# EAGLE schematic Replicape_B3A (EAGLE 7.2.0)
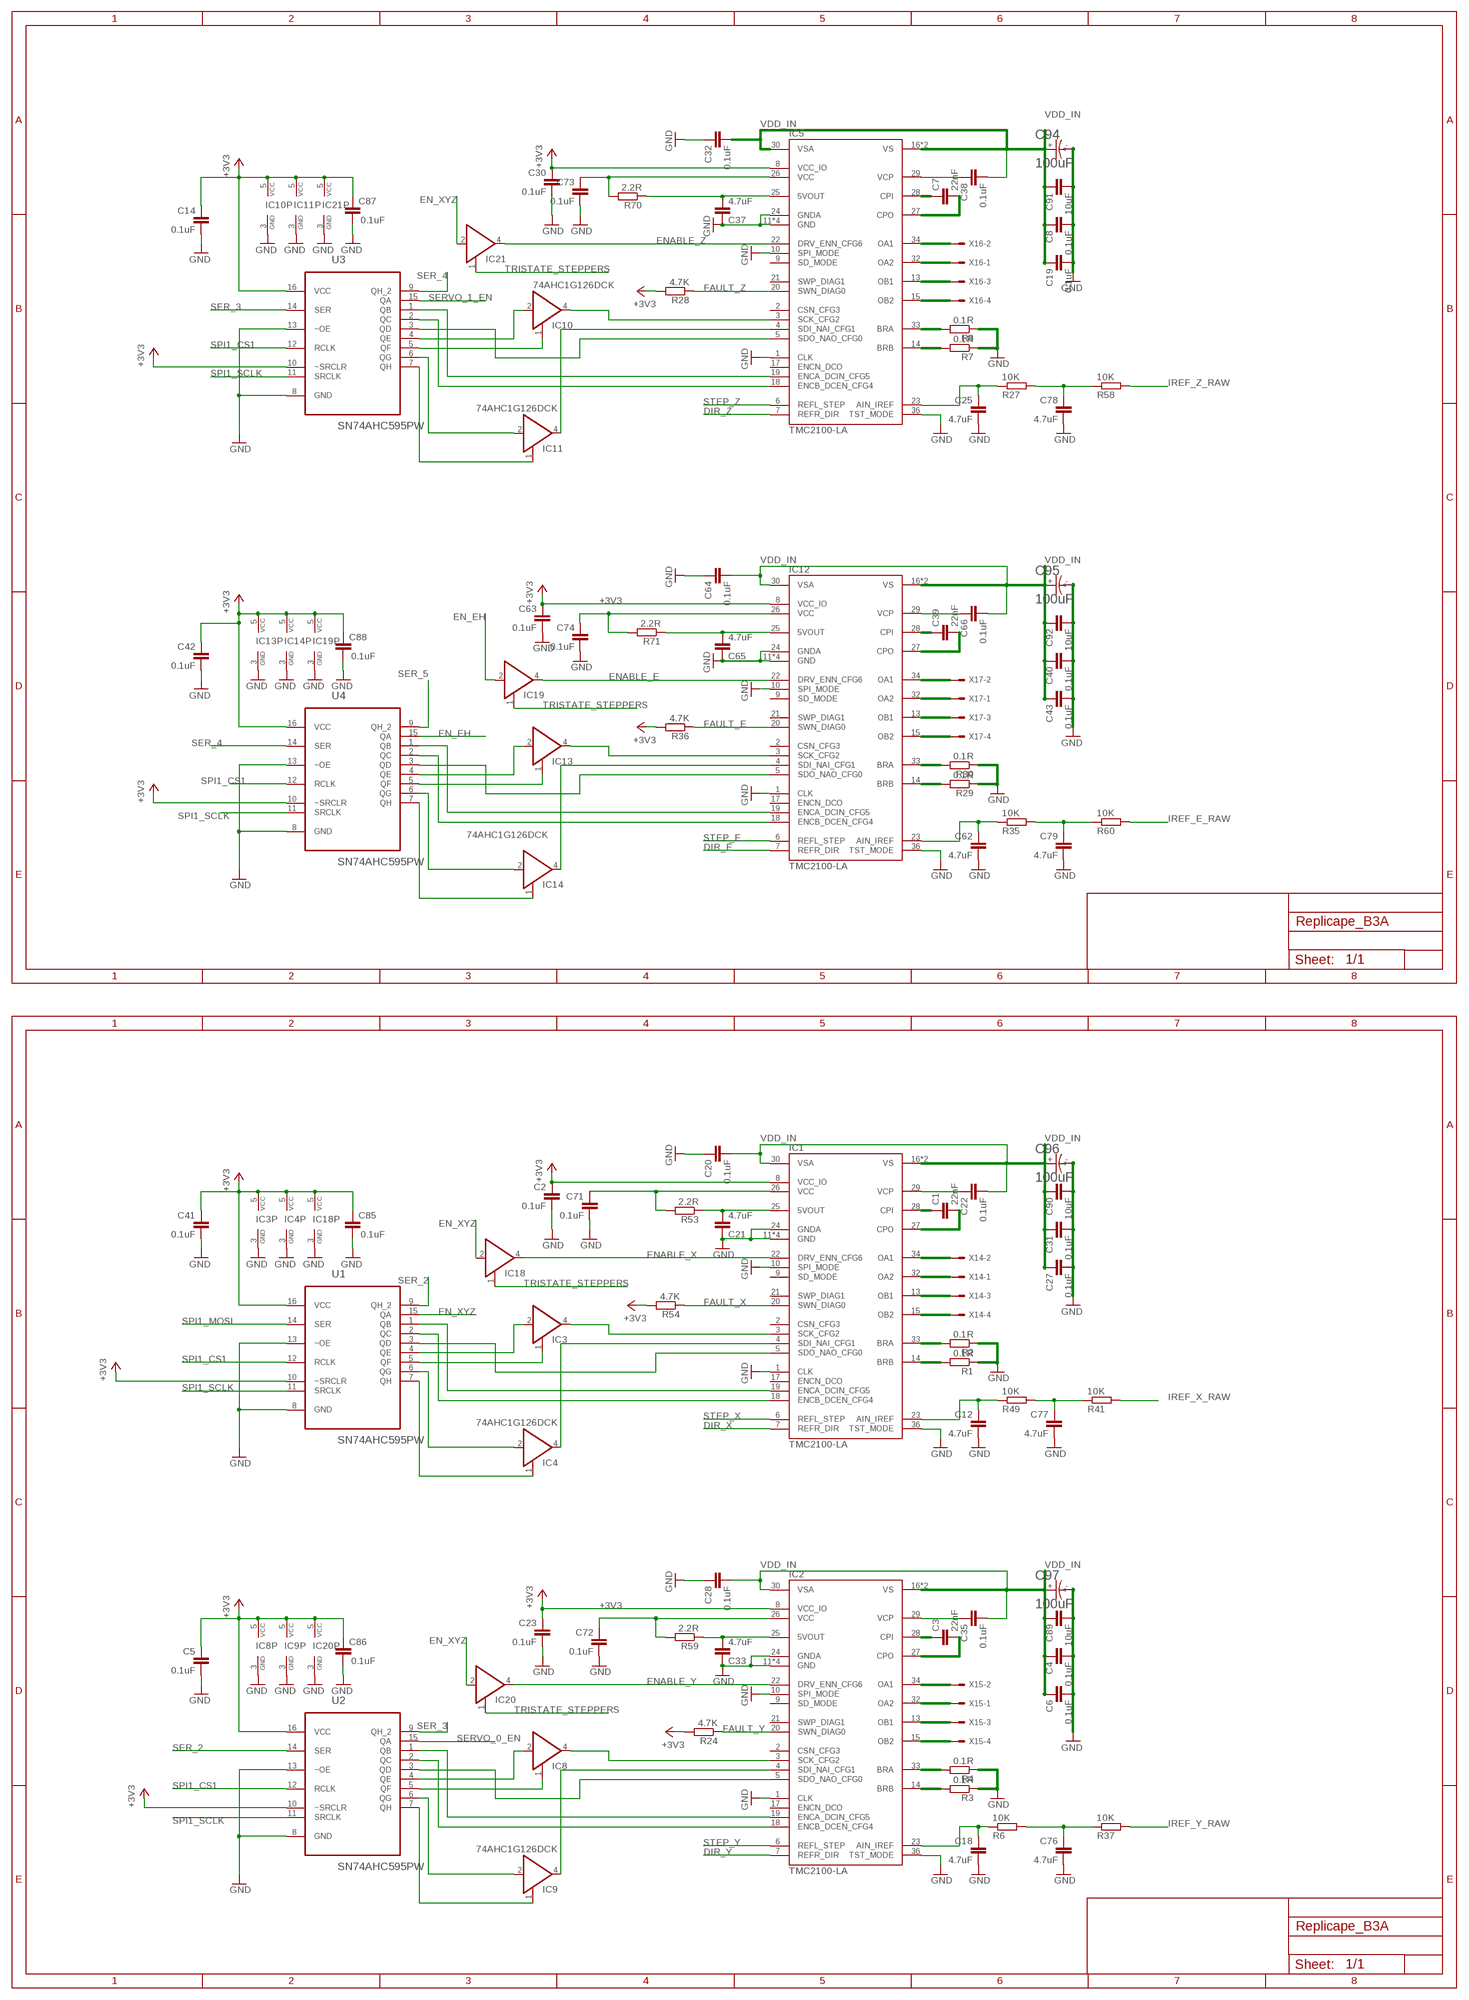
[diagram p0: schematic, sheet 1, part 1 of 3]
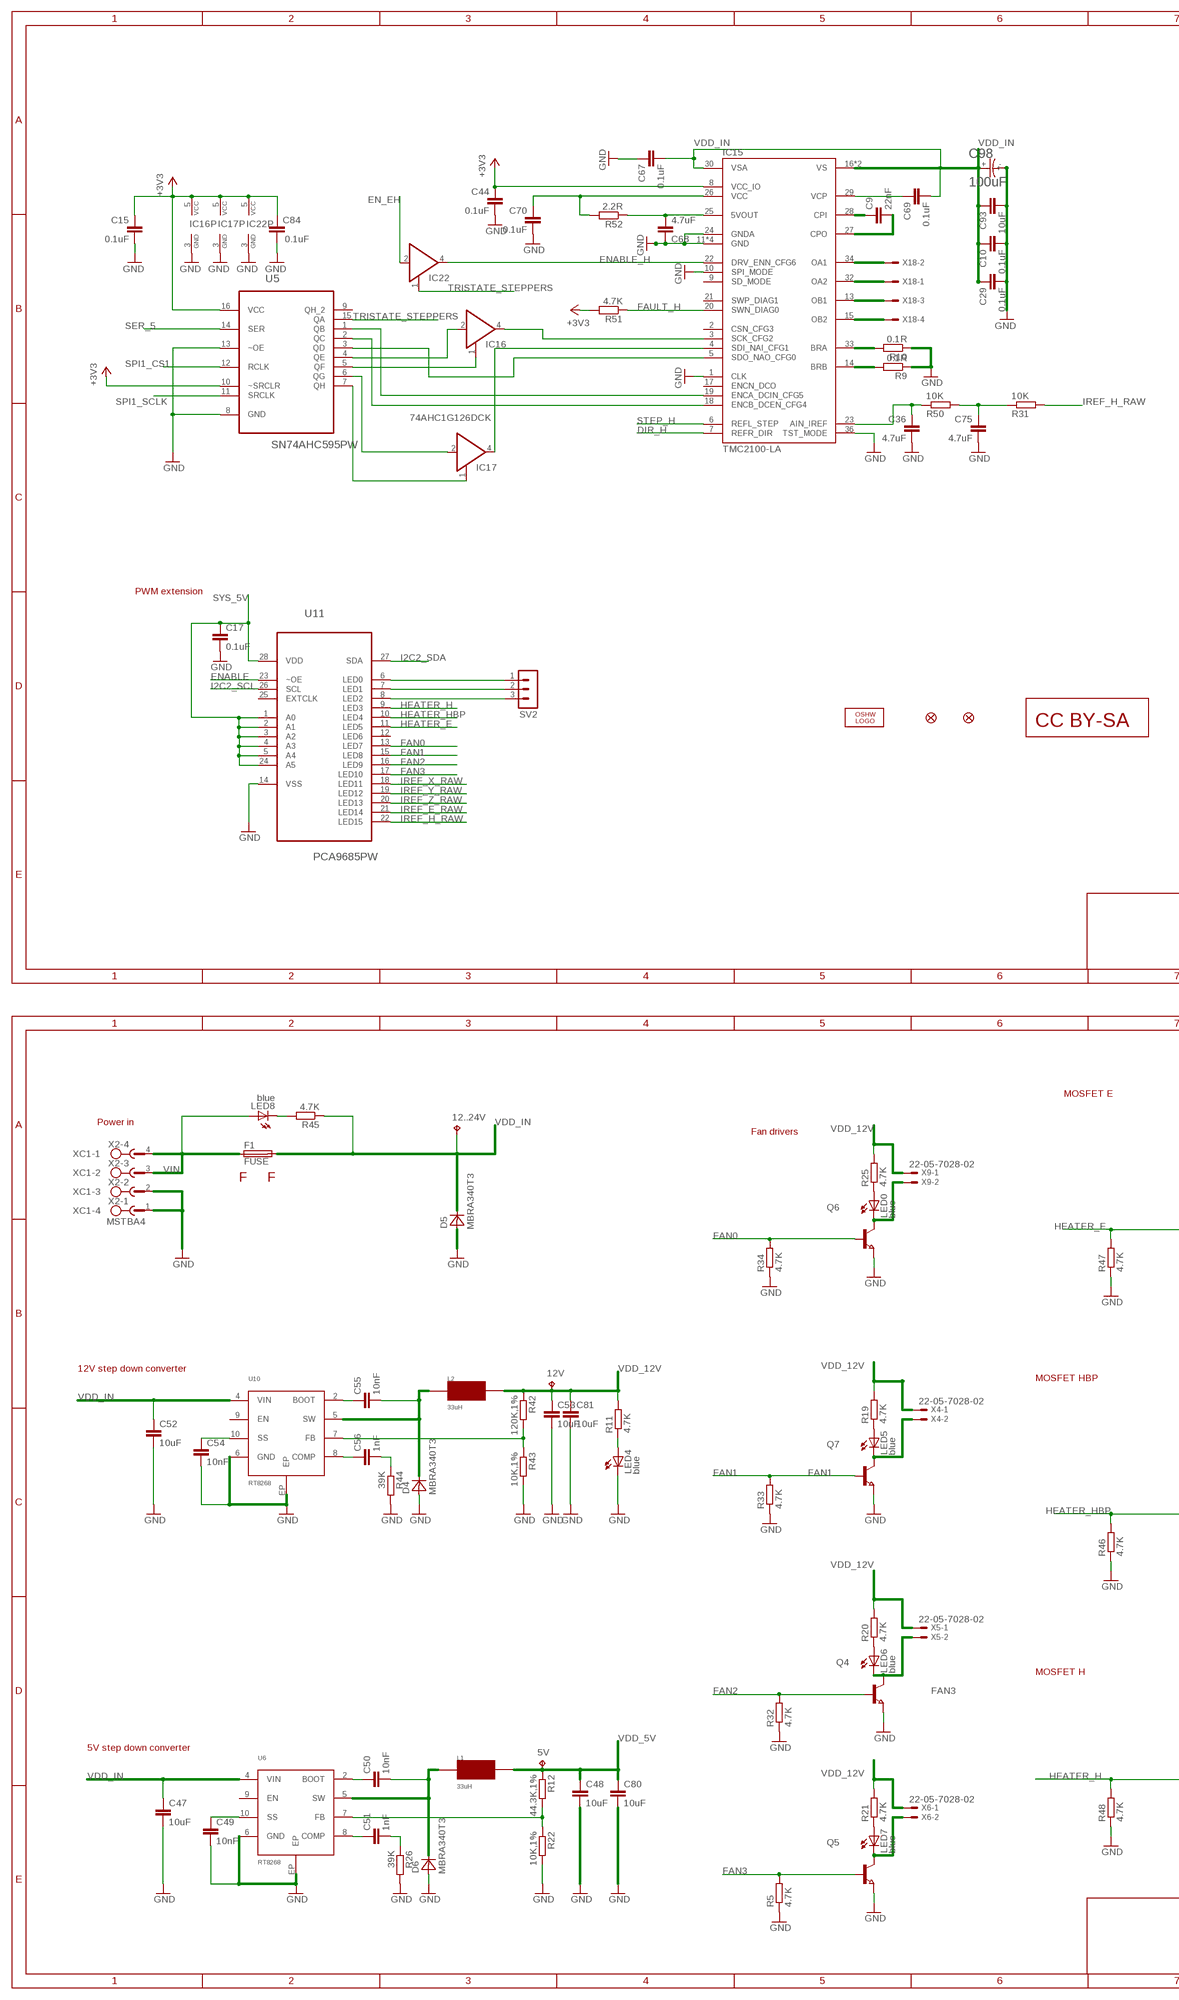
[diagram p1: schematic, sheet 1, part 2 of 3]
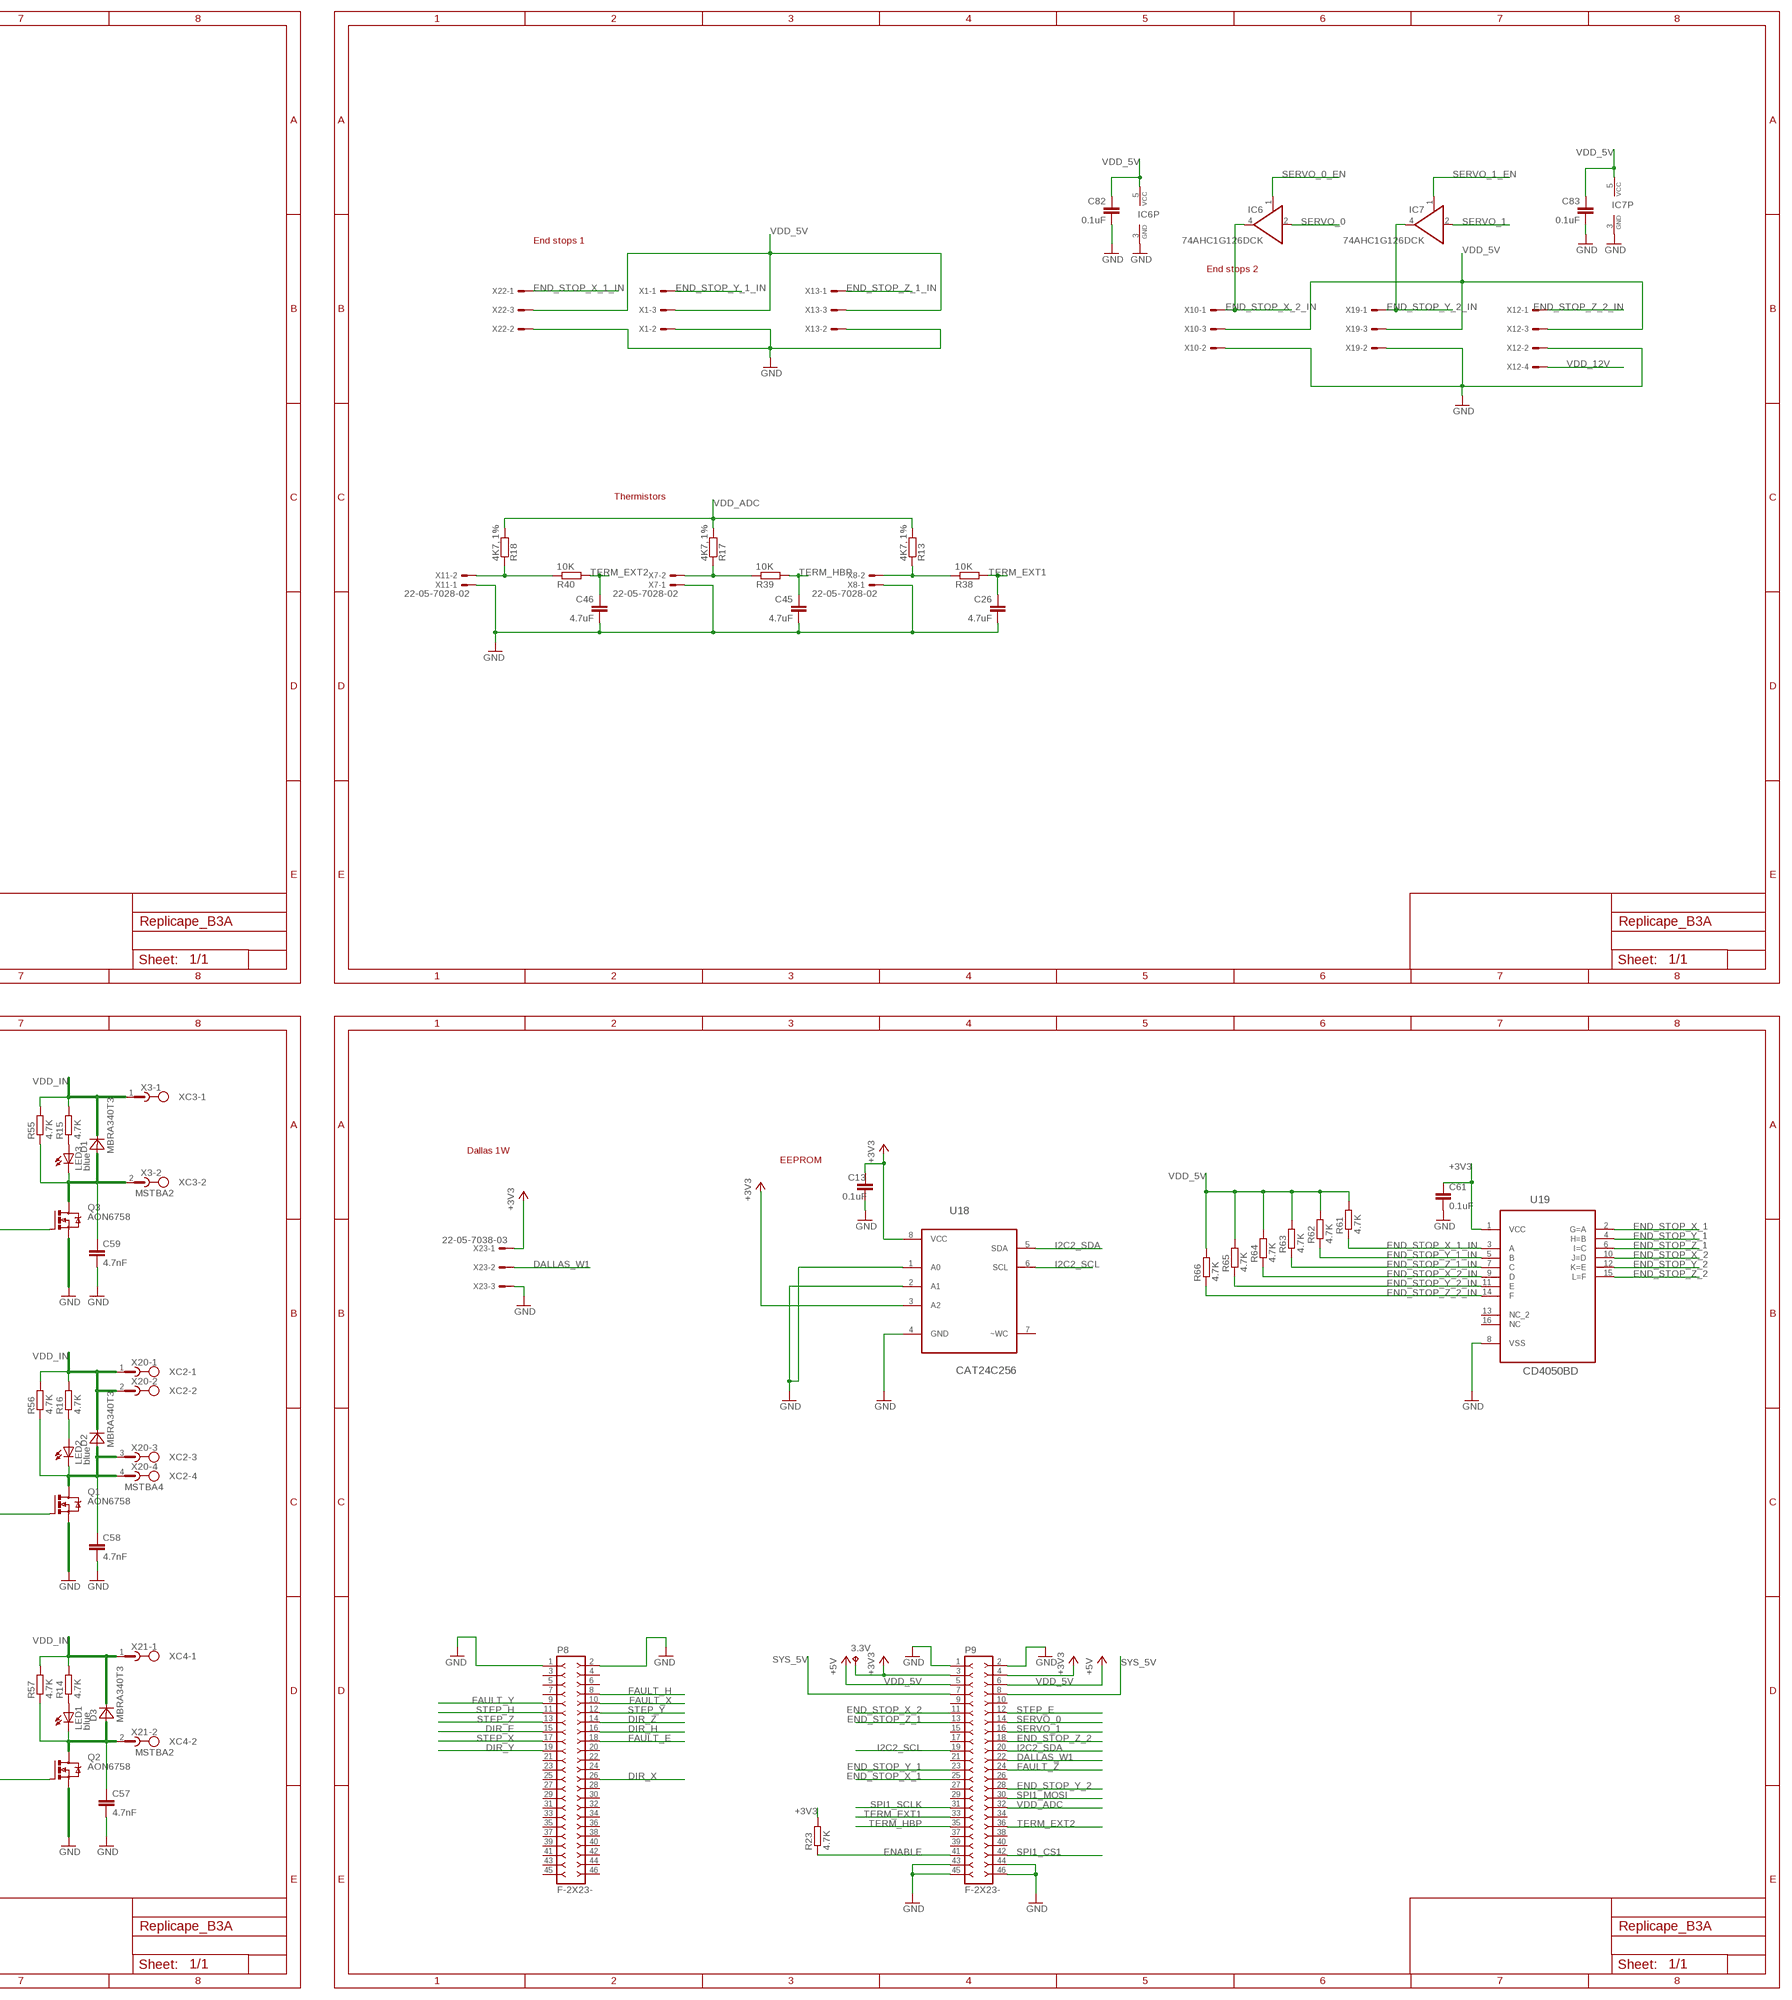
[diagram p2: schematic, sheet 1, part 3 of 3]

## Parts
3.3V  TPB1,27  [B1,27]
5V  TPB1,27  [B1,27]
12..24V  TPB1,27  [B1,27]
12V  TPB1,27  [B1,27]
C1  22nF  C-EUC0402  [C0402]
C2  0.1uF  C-EUC0402  [C0402]
C3  22nF  C-EUC0402  [C0402]
C4  0.1uF  C-EUC0402  [C0402]
C5  0.1uF  C-EUC0402  [C0402]
C6  0.1uF  C-EUC0402  [C0402]
C7  22nF  C-EUC0402  [C0402]
C8  0.1uF  C-EUC0402  [C0402]
C9  22nF  C-EUC0402  [C0402]
C10  0.1uF  C-EUC0402  [C0402]
C12  4.7uF  C-EUC0402  [C0402]
C13  0.1uF  C-EUC0402  [C0402]
C14  0.1uF  C-EUC0402  [C0402]
C15  0.1uF  C-EUC0402  [C0402]
C17  0.1uF  C-EUC0402  [C0402]
C18  4.7uF  C-EUC0402  [C0402]
C19  0.1uF  C-EUC0402  [C0402]
C20  0.1uF  C-EUC0402  [C0402]
C21  4.7uF  C-EUC0402  [C0402]
C22  0.1uF  C-EUC0402  [C0402]
C23  0.1uF  C-EUC0402  [C0402]
C25  4.7uF  C-EUC0402  [C0402]
C26  4.7uF  C-EUC0402  [C0402]
C27  0.1uF  C-EUC0402  [C0402]
C28  0.1uF  C-EUC0402  [C0402]
C29  0.1uF  C-EUC0402  [C0402]
C30  0.1uF  C-EUC0402  [C0402]
C31  0.1uF  C-EUC0402  [C0402]
C32  0.1uF  C-EUC0402  [C0402]
C33  4.7uF  C-EUC0402  [C0402]
C35  0.1uF  C-EUC0402  [C0402]
C36  4.7uF  C-EUC0402  [C0402]
C37  4.7uF  C-EUC0402  [C0402]
C38  0.1uF  C-EUC0402  [C0402]
C39  22nF  C-EUC0402  [C0402]
C40  0.1uF  C-EUC0402  [C0402]
C41  0.1uF  C-EUC0402  [C0402]
C42  0.1uF  C-EUC0402  [C0402]
C43  0.1uF  C-EUC0402  [C0402]
C44  0.1uF  C-EUC0402  [C0402]
C45  4.7uF  C-EUC0402  [C0402]
C46  4.7uF  C-EUC0402  [C0402]
C47  10uF  C-EUC1206  [C1206]
C48  10uF  C-EUC1206  [C1206]
C49  10nF  C-EUC0402  [C0402]
C50  10nF  C-EUC0402  [C0402]
C51  1nF  C-EUC0402  [C0402]
C52  10uF  C-EUC1206  [C1206]
C53  10uF  C-EUC1206  [C1206]
C54  10nF  C-EUC0402  [C0402]
C55  10nF  C-EUC0402  [C0402]
C56  1nF  C-EUC0402  [C0402]
C57  4.7nF  C-EUC0402  [C0402]
C58  4.7nF  C-EUC0402  [C0402]
C59  4.7nF  C-EUC0402  [C0402]
C61  0.1uF  C-EUC0402  [C0402]
C62  4.7uF  C-EUC0402  [C0402]
C63  0.1uF  C-EUC0402  [C0402]
C64  0.1uF  C-EUC0402  [C0402]
C65  4.7uF  C-EUC0402  [C0402]
C66  0.1uF  C-EUC0402  [C0402]
C67  0.1uF  C-EUC0402  [C0402]
C68  4.7uF  C-EUC0402  [C0402]
C69  0.1uF  C-EUC0402  [C0402]
C70  0.1uF  C-EUC0402  [C0402]
C71  0.1uF  C-EUC0402  [C0402]
C72  0.1uF  C-EUC0402  [C0402]
C73  0.1uF  C-EUC0402  [C0402]
C74  0.1uF  C-EUC0402  [C0402]
C75  4.7uF  C-EUC0402  [C0402]
C76  4.7uF  C-EUC0402  [C0402]
C77  4.7uF  C-EUC0402  [C0402]
C78  4.7uF  C-EUC0402  [C0402]
C79  4.7uF  C-EUC0402  [C0402]
C80  10uF  C-EUC1206  [C1206]
C81  10uF  C-EUC1206  [C1206]
C82  0.1uF  C-EUC0402  [C0402]
C83  0.1uF  C-EUC0402  [C0402]
C84  0.1uF  C-EUC0402  [C0402]
C85  0.1uF  C-EUC0402  [C0402]
C86  0.1uF  C-EUC0402  [C0402]
C87  0.1uF  C-EUC0402  [C0402]
C88  0.1uF  C-EUC0402  [C0402]
C89  10uF  C-EUC0805  [C0805]
C90  10uF  C-EUC0805  [C0805]
C91  10uF  C-EUC0805  [C0805]
C92  10uF  C-EUC0805  [C0805]
C93  10uF  C-EUC0805  [C0805]
C94  100uF  C  [RHS1V10MCN1GS]
C95  100uF  C  [RHS1V10MCN1GS]
C96  100uF  C  [RHS1V10MCN1GS]
C97  100uF  C  [RHS1V10MCN1GS]
C98  100uF  C  [RHS1V10MCN1GS]
D1  MBRA340T3  [SMA]
D2  MBRA340T3  [SMA]
D3  MBRA340T3  [SMA]
D4  MBRA340T3  [SMA]
D5  MBRA340T3  [SMA]
D6  MBRA340T3  [SMA]
F1  FUSE  [3557]
FH1  FUSE-HOLDER  [FUSE-HOLDER]
FH2  FUSE-HOLDER  [FUSE-HOLDER]
IC1  TMC2100-LA  [QFN36-PAD]
IC2  TMC2100-LA  [QFN36-PAD]
IC3  74AHC1G126DCK  [SC70-5]
IC4  74AHC1G126DCK  [SC70-5]
IC5  TMC2100-LA  [QFN36-PAD]
IC6  74AHC1G126DCK  [SC70-5]
IC7  74AHC1G126DCK  [SC70-5]
IC8  74AHC1G126DCK  [SC70-5]
IC9  74AHC1G126DCK  [SC70-5]
IC10  74AHC1G126DCK  [SC70-5]
IC11  74AHC1G126DCK  [SC70-5]
IC12  TMC2100-LA  [QFN36-PAD]
IC13  74AHC1G126DCK  [SC70-5]
IC14  74AHC1G126DCK  [SC70-5]
IC15  TMC2100-LA  [QFN36-PAD]
IC16  74AHC1G126DCK  [SC70-5]
IC17  74AHC1G126DCK  [SC70-5]
IC18  74AHC1G126DCK  [SC70-5]
IC19  74AHC1G126DCK  [SC70-5]
IC20  74AHC1G126DCK  [SC70-5]
IC21  74AHC1G126DCK  [SC70-5]
IC22  74AHC1G126DCK  [SC70-5]
JP1  FIDUCIAL1X2.5  [FIDUCIAL-1X2.5]
JP2  FIDUCIAL1X2.5  [FIDUCIAL-1X2.5]
L1  33uH  RT8040T330  [NR8040T330]
L2  33uH  RT8040T330  [NR8040T330]
LED0  blue  LEDCHIP-LED0603  [CHIP-LED0603]
LED1  blue  LEDCHIP-LED0603  [CHIP-LED0603]
LED2  blue  LEDCHIP-LED0603  [CHIP-LED0603]
LED3  blue  LEDCHIP-LED0603  [CHIP-LED0603]
LED4  blue  LEDCHIP-LED0603  [CHIP-LED0603]
LED5  blue  LEDCHIP-LED0603  [CHIP-LED0603]
LED6  blue  LEDCHIP-LED0603  [CHIP-LED0603]
LED7  blue  LEDCHIP-LED0603  [CHIP-LED0603]
LED8  blue  LEDCHIP-LED0603  [CHIP-LED0603]
LOGO1  OSHW_LOGO_FILLX0200-NT  [OSHW_FILLX200_NOTEXT]
P8  F-2X23-  [DIL-100-2X23]
P9  F-2X23-  [DIL-100-2X23]
Q1  AON6758  [8-DFN-EP-(5X6)]
Q2  AON6758  [8-DFN-EP-(5X6)]
Q3  AON6758  [8-DFN-EP-(5X6)]
Q4  NPN-TRANSISTOR_SOT23  [SOT23]
Q5  NPN-TRANSISTOR_SOT23  [SOT23]
Q6  NPN-TRANSISTOR_SOT23  [SOT23]
Q7  NPN-TRANSISTOR_SOT23  [SOT23]
R1  0.1R  R-EU_R0805  [R0805]
R2  0.1R  R-EU_R0805  [R0805]
R3  0.1R  R-EU_R0805  [R0805]
R4  0.1R  R-EU_R0805  [R0805]
R5  4.7K  R-EU_R0402  [R0402]
R6  10K  R-EU_R0402  [R0402]
R7  0.1R  R-EU_R0805  [R0805]
R8  0.1R  R-EU_R0805  [R0805]
R9  0.1R  R-EU_R0805  [R0805]
R10  0.1R  R-EU_R0805  [R0805]
R11  4.7K  R-EU_R0402  [R0402]
R12  44.3K,1%  R-EU_R0402  [R0402]
R13  4K7, 1%  R-EU_R0402  [R0402]
R14  4.7K  R-EU_R0402  [R0402]
R15  4.7K  R-EU_R0402  [R0402]
R16  4.7K  R-EU_R0402  [R0402]
R17  4K7, 1%  R-EU_R0402  [R0402]
R18  4K7, 1%  R-EU_R0402  [R0402]
R19  4.7K  R-EU_R0402  [R0402]
R20  4.7K  R-EU_R0402  [R0402]
R21  4.7K  R-EU_R0402  [R0402]
R22  10K,1%  R-EU_R0402  [R0402]
R23  4.7K  R-EU_R0402  [R0402]
R24  4.7K  R-EU_R0402  [R0402]
R25  4.7K  R-EU_R0402  [R0402]
R26  39K  R-EU_R0402  [R0402]
R27  10K  R-EU_R0402  [R0402]
R28  4.7K  R-EU_R0402  [R0402]
R29  0.1R  R-EU_R0805  [R0805]
R30  0.1R  R-EU_R0805  [R0805]
R31  10K  R-EU_R0402  [R0402]
R32  4.7K  R-EU_R0402  [R0402]
R33  4.7K  R-EU_R0402  [R0402]
R34  4.7K  R-EU_R0402  [R0402]
R35  10K  R-EU_R0402  [R0402]
R36  4.7K  R-EU_R0402  [R0402]
R37  10K  R-EU_R0402  [R0402]
R38  10K  R-EU_R0402  [R0402]
R39  10K  R-EU_R0402  [R0402]
R40  10K  R-EU_R0402  [R0402]
R41  10K  R-EU_R0402  [R0402]
R42  120K,1%  R-EU_R0402  [R0402]
R43  10K,1%  R-EU_R0402  [R0402]
R44  39K  R-EU_R0402  [R0402]
R45  4.7K  R-EU_R0402  [R0402]
R46  4.7K  R-EU_R0402  [R0402]
R47  4.7K  R-EU_R0402  [R0402]
R48  4.7K  R-EU_R0402  [R0402]
R49  10K  R-EU_R0402  [R0402]
R50  10K  R-EU_R0402  [R0402]
R51  4.7K  R-EU_R0402  [R0402]
R52  2.2R  R-EU_R0402  [R0402]
R53  2.2R  R-EU_R0402  [R0402]
R54  4.7K  R-EU_R0402  [R0402]
R55  4.7K  R-EU_R0402  [R0402]
R56  4.7K  R-EU_R0402  [R0402]
R57  4.7K  R-EU_R0402  [R0402]
R58  10K  R-EU_R0402  [R0402]
R59  2.2R  R-EU_R0402  [R0402]
R60  10K  R-EU_R0402  [R0402]
R61  4.7K  R-EU_R0402  [R0402]
R62  4.7K  R-EU_R0402  [R0402]
R63  4.7K  R-EU_R0402  [R0402]
R64  4.7K  R-EU_R0402  [R0402]
R65  4.7K  R-EU_R0402  [R0402]
R66  4.7K  R-EU_R0402  [R0402]
R70  2.2R  R-EU_R0402  [R0402]
R71  2.2R  R-EU_R0402  [R0402]
SV2  MA03-1  [MA03-1]
U1  SN74AHC595PW  [SOP65P640X120-16N]
U2  SN74AHC595PW  [SOP65P640X120-16N]
U3  SN74AHC595PW  [SOP65P640X120-16N]
U4  SN74AHC595PW  [SOP65P640X120-16N]
U5  SN74AHC595PW  [SOP65P640X120-16N]
U6  RT8268  [MSOP10]
U10  RT8268  [MSOP10]
U11  PCA9685PW  [SOP65P640X110-28N]
U18  CAT24C256  [SOIC127P600X175-8N]
U19  CD4050BD  [SOIC127P600X175-16N]
U$4  CC-BY-SA  [CC-BY-SA]
X1  22-05-7038-03  [7395-03]
X2  MSTBA4  [MSTBA4]
X3  MSTBA2  [MSTBA2]
X4  22-05-7028-02  [7395-02]
X5  22-05-7028-02  [7395-02]
X6  22-05-7028-02  [7395-02]
X7  22-05-7028-02  [7395-02]
X8  22-05-7028-02  [7395-02]
X9  22-05-7028-02  [7395-02]
X10  22-05-7038-03  [7395-03]
X11  22-05-7028-02  [7395-02]
X12  22-05-7048-04  [7395-04]
X13  22-05-7038-03  [7395-03]
X14  22-05-7048-04  [7395-04]
X15  22-05-7048-04  [7395-04]
X16  22-05-7048-04  [7395-04]
X17  22-05-7048-04  [7395-04]
X18  22-05-7048-04  [7395-04]
X19  22-05-7038-03  [7395-03]
X20  MSTBA4  [MSTBA4]
X21  MSTBA2  [MSTBA2]
X22  22-05-7038-03  [7395-03]
X23  22-05-7038-03  [7395-03]
XC1  MSTBA4-CONNECTOR  [MSTBA4-CONNECTOR]
XC2  MSTBA4-CONNECTOR  [MSTBA4-CONNECTOR]
XC3  MSTBV2-CONNECTOR  [MSTBA2-CONNECTOR]
XC4  MSTBV2-CONNECTOR  [MSTBA2-CONNECTOR]

## Nets
+3V3: 3.3V.TP C2.1 C5.1 C13.1 C14.1 C15.1 C23.1 C30.1 C41.1 C42.1 C44.1 C61.1 C63.1 C84.1 C85.1 C86.1 C87.1 C88.1 IC1.8(VCC_IO) IC2.8(VCC_IO) IC3.5(VCC) IC4.5(VCC) IC5.8(VCC_IO) IC8.5(VCC) IC9.5(VCC) IC10.5(VCC) IC11.5(VCC) IC12.8(VCC_IO) IC13.5(VCC) IC14.5(VCC) IC15.8(VCC_IO) IC16.5(VCC) IC17.5(VCC) IC18.5(VCC) IC19.5(VCC) IC20.5(VCC) IC21.5(VCC) IC22.5(VCC) P9.3 P9.4 R23.2 R24.2 R28.2 R36.2 R51.2 R54.2 U1.10(~SRCLR) U1.16(VCC) U2.10(~SRCLR) U2.16(VCC) U3.10(~SRCLR) U3.16(VCC) U4.10(~SRCLR) U4.16(VCC) U5.10(~SRCLR) U5.16(VCC) U18.3(A2) U18.8(VCC) U19.1(VCC) X23.1
DALLAS_W1: P9.22 X23.2
DIR_E: IC12.7(REFR_DIR) P8.15
DIR_H: IC15.7(REFR_DIR) P8.16
DIR_X: IC1.7(REFR_DIR) P8.26
DIR_Y: IC2.7(REFR_DIR) P8.19
DIR_Z: IC5.7(REFR_DIR) P8.14
EN_EH: IC19.2(I) IC22.2(I) U4.15(QA)
EN_XYZ: IC18.2(I) IC20.2(I) IC21.2(I) U1.15(QA)
ENABLE: P9.41 R23.1 U11.23(~OE)
ENABLE_E: IC12.22(DRV_ENN_CFG6) IC19.4(O)
ENABLE_H: IC15.22(DRV_ENN_CFG6) IC22.4(O)
ENABLE_X: IC1.22(DRV_ENN_CFG6) IC18.4(O)
ENABLE_Y: IC2.22(DRV_ENN_CFG6) IC20.4(O)
ENABLE_Z: IC5.22(DRV_ENN_CFG6) IC21.4(O)
END_STOP_X_1: P9.25 U19.2(G=A)
END_STOP_X_1_IN: R61.1 U19.3(A) X22.1
END_STOP_X_2: P9.11 U19.10(J=D)
END_STOP_X_2_IN: IC6.4(O) R64.1 U19.9(D) X10.1
END_STOP_Y_1: P9.23 U19.4(H=B)
END_STOP_Y_1_IN: R62.1 U19.5(B) X1.1
END_STOP_Y_2: P9.28 U19.12(K=E)
END_STOP_Y_2_IN: IC7.4(O) R65.1 U19.11(E) X19.1
END_STOP_Z_1: P9.13 U19.6(I=C)
END_STOP_Z_1_IN: R63.1 U19.7(C) X13.1
END_STOP_Z_2: P9.18 U19.15(L=F)
END_STOP_Z_2_IN: R66.1 U19.14(F) X12.1
FAN0: Q6.1(B) R34.2 U11.13(LED7)
FAN1: Q7.1(B) R33.2 U11.15(LED8)
FAN2: Q4.1(B) R32.2 U11.16(LED9)
FAN3: Q5.1(B) R5.2 U11.17(LED10)
FAULT_E: IC12.20(SWN_DIAG0) P8.18 R36.1
FAULT_H: IC15.20(SWN_DIAG0) P8.8 R51.1
FAULT_X: IC1.20(SWN_DIAG0) P8.10 R54.1
FAULT_Y: IC2.20(SWN_DIAG0) P8.9 R24.1
FAULT_Z: IC5.20(SWN_DIAG0) P9.24 R28.1
GND: C2.2 C4.2 C5.2 C6.2 C8.2 C10.2 C12.2 C13.2 C14.2 C15.2 C17.2 C18.2 C19.2 C20.1 C21.1 C23.2 C25.2 C26.2 C27.2 C28.1 C29.2 C30.2 C31.2 C32.1 C33.1 C36.2 C37.1 C40.2 C41.2 C42.2 C43.2 C44.2 C45.2 C46.2 C47.2 C48.2 C49.2 C52.2 C53.2 C54.2 C57.2 C58.2 C59.2 C61.2 C62.2 C63.2 C64.1 C65.1 C67.1 C68.1 C70.2 C71.2 C72.2 C73.2 C74.2 C75.2 C76.2 C77.2 C78.2 C79.2 C80.2 C81.2 C82.2 C83.2 C84.2 C85.2 C86.2 C87.2 C88.2 C89.2 C90.2 C91.2 C92.2 C93.2 C94.- C95.- C96.- C97.- C98.- D4.A D5.A D6.A IC1.1(CLK) IC1.10(SPI_MODE) IC1.11(GND) IC1.12(GND) IC1.24(GNDA) IC1.35(GND) IC1.36(TST_MODE) IC1.TP(GND) IC2.1(CLK) IC2.10(SPI_MODE) IC2.11(GND) IC2.12(GND) IC2.24(GNDA) IC2.35(GND) IC2.36(TST_MODE) IC2.TP(GND) IC3.3(GND) IC4.3(GND) IC5.1(CLK) IC5.10(SPI_MODE) IC5.11(GND) IC5.12(GND) IC5.24(GNDA) IC5.35(GND) IC5.36(TST_MODE) IC5.TP(GND) IC6.3(GND) IC7.3(GND) IC8.3(GND) IC9.3(GND) IC10.3(GND) IC11.3(GND) IC12.1(CLK) IC12.10(SPI_MODE) IC12.11(GND) IC12.12(GND) IC12.24(GNDA) IC12.35(GND) IC12.36(TST_MODE) IC12.TP(GND) IC13.3(GND) IC14.3(GND) IC15.1(CLK) IC15.10(SPI_MODE) IC15.11(GND) IC15.12(GND) IC15.24(GNDA) IC15.35(GND) IC15.36(TST_MODE) IC15.TP(GND) IC16.3(GND) IC17.3(GND) IC18.3(GND) IC19.3(GND) IC20.3(GND) IC21.3(GND) IC22.3(GND) LED4.C P8.1 P8.2 P9.1 P9.2 P9.43 P9.44 P9.45 P9.46 Q1.1(S) Q1.2(S) Q1.3(S) Q2.1(S) Q2.2(S) Q2.3(S) Q3.1(S) Q3.2(S) Q3.3(S) Q4.2(E) Q5.2(E) Q6.2(E) Q7.2(E) R1.1 R2.1 R3.1 R4.1 R5.1 R7.1 R8.1 R9.1 R10.1 R22.2 R26.2 R29.1 R30.1 R32.1 R33.1 R34.1 R43.2 R44.2 R46.1 R47.1 R48.1 U1.8(GND) U1.13(~OE) U2.8(GND) U2.13(~OE) U3.8(GND) U3.13(~OE) U4.8(GND) U4.13(~OE) U5.8(GND) U5.13(~OE) U6.6(GND) U6.EP U10.6(GND) U10.EP U11.14(VSS) U18.1(A0) U18.2(A1) U18.4(GND) U19.8(VSS) X1.2 X2.1 X2.2 X7.1 X8.1 X10.2 X11.1 X12.2 X13.2 X19.2 X22.2 X23.3
HEATER_E: Q3.4(G) R47.2 U11.11(LED5)
HEATER_H: Q2.4(G) R48.2 U11.9(LED3)
HEATER_HBP: Q1.4(G) R46.2 U11.10(LED4)
I2C2_SCL: P9.19 U11.26(SCL) U18.6(SCL)
I2C2_SDA: P9.20 U11.27(SDA) U18.5(SDA)
IREF_E: C79.1 R35.2 R60.1
IREF_E_RAW: R60.2 U11.21(LED14)
IREF_H: C75.1 R31.1 R50.2
IREF_H_RAW: R31.2 U11.22(LED15)
IREF_X: C77.1 R41.1 R49.2
IREF_X_RAW: R41.2 U11.18(LED11)
IREF_Y: C76.1 R6.2 R37.1
IREF_Y_RAW: R37.2 U11.19(LED12)
IREF_Z: C78.1 R27.2 R58.1
IREF_Z_RAW: R58.2 U11.20(LED13)
N$1: SV2.1 U11.6(LED0)
N$2: IC2.13(OB1) X15.3
N$3: C3.2 IC2.27(CPO)
N$4: IC4.1(OE) U1.7(QH)
N$5: IC4.2(I) U1.6(QG)
N$6: IC1.18(ENCB_DCEN_CFG4) U1.2(QC)
N$8: LED8.C R45.2
N$9: LED5.A R19.1
N$11: LED0.C Q6.3(C) X9.2
N$12: C9.2 IC15.27(CPO)
N$13: IC15.14(BRB) R9.2
N$14: C7.2 IC5.27(CPO)
N$15: IC5.14(BRB) R7.2
N$16: C1.1 IC1.28(CPI)
N$17: C1.2 IC1.27(CPO)
N$18: IC1.14(BRB) R1.2
N$19: IC1.33(BRA) R2.2
N$20: C12.1 IC1.23(AIN_IREF) R49.1
N$21: LED0.A R25.1
N$22: IC2.32(OA2) X15.1
N$23: R12.2 R22.1 U6.7(FB)
N$24: IC5.33(BRA) R8.2
N$25: C50.2 D6.C L1.P$2 U6.5(SW)
N$26: C25.1 IC5.23(AIN_IREF) R27.1
N$27: C7.1 IC5.28(CPI)
N$28: IC5.3(SCK_CFG2) IC10.4(O)
N$29: IC5.15(OB2) X16.4
N$30: IC15.33(BRA) R10.2
N$31: C21.2 IC1.25(5VOUT) R53.1
N$32: IC5.32(OA2) X16.1
N$33: C22.1 IC1.29(VCP)
N$34: IC3.2(I) U1.4(QE)
N$35: IC2.14(BRB) R3.2
N$36: IC2.33(BRA) R4.2
N$37: IC5.13(OB1) X16.3
N$38: C18.1 IC2.23(AIN_IREF) R6.1
N$39: IC12.13(OB1) X17.3
N$40: IC3.1(OE) U1.5(QF)
N$41: C3.1 IC2.28(CPI)
N$42: IC2.3(SCK_CFG2) IC8.4(O)
N$43: IC1.19(ENCA_DCIN_CFG5) U1.1(QB)
N$44: IC1.5(SDO_NAO_CFG0) U1.3(QD)
N$45: IC2.15(OB2) X15.4
N$46: IC2.34(OA1) X15.2
N$47: C33.2 IC2.25(5VOUT) R59.1
N$48: C35.1 IC2.29(VCP)
N$49: IC2.4(SDI_NAI_CFG1) IC9.4(O)
N$50: IC5.34(OA1) X16.2
N$51: C37.2 IC5.25(5VOUT) R70.1
N$52: C38.1 IC5.29(VCP)
N$53: IC2.5(SDO_NAO_CFG0) U2.3(QD)
N$54: IC5.4(SDI_NAI_CFG1) IC11.4(O)
N$55: IC5.5(SDO_NAO_CFG0) U3.3(QD)
N$56: IC2.18(ENCB_DCEN_CFG4) U2.2(QC)
N$57: IC5.18(ENCB_DCEN_CFG4) U3.2(QC)
N$58: IC5.19(ENCA_DCIN_CFG5) U3.1(QB)
N$59: IC11.1(OE) U3.7(QH)
N$60: C49.1 U6.10(SS)
N$61: IC11.2(I) U3.6(QG)
N$62: IC10.1(OE) U3.5(QF)
N$63: IC10.2(I) U3.4(QE)
N$64: C57.1 D3.A LED1.C Q2.5(D) Q2.6(D) Q2.7(D) Q2.8(D) Q2.TH(D) R57.1 X21.2
N$65: IC2.19(ENCA_DCIN_CFG5) U2.1(QB)
N$66: IC9.1(OE) U2.7(QH)
N$67: IC9.2(I) U2.6(QG)
N$68: IC8.1(OE) U2.5(QF)
N$69: IC8.2(I) U2.4(QE)
N$70: C39.2 IC12.27(CPO)
N$71: IC12.14(BRB) R29.2
N$72: IC12.33(BRA) R30.2
N$73: C50.1 U6.2(BOOT)
N$74: C62.1 IC12.23(AIN_IREF) R35.1
N$75: C39.1 IC12.28(CPI)
N$76: IC12.3(SCK_CFG2) IC13.4(O)
N$77: IC12.15(OB2) X17.4
N$78: IC12.34(OA1) X17.2
N$79: C65.2 IC12.25(5VOUT) R71.1
N$80: C66.1 IC12.29(VCP)
N$81: IC12.4(SDI_NAI_CFG1) IC14.4(O)
N$82: IC12.5(SDO_NAO_CFG0) U4.3(QD)
N$83: IC12.18(ENCB_DCEN_CFG4) U4.2(QC)
N$84: IC12.19(ENCA_DCIN_CFG5) U4.1(QB)
N$85: IC14.1(OE) U4.7(QH)
N$86: IC14.2(I) U4.6(QG)
N$87: IC13.1(OE) U4.5(QF)
N$88: C51.1 U6.8(COMP)
N$89: C36.1 IC15.23(AIN_IREF) R50.1
N$90: C9.1 IC15.28(CPI)
N$91: IC15.3(SCK_CFG2) IC16.4(O)
N$92: IC15.15(OB2) X18.4
N$93: IC13.2(I) U4.4(QE)
N$94: IC15.34(OA1) X18.2
N$95: C68.2 IC15.25(5VOUT) R52.1
N$96: LED4.A R11.1
N$97: C51.2 R26.1
N$98: C69.1 IC15.29(VCP)
N$99: IC15.4(SDI_NAI_CFG1) IC17.4(O)
N$100: IC15.5(SDO_NAO_CFG0) U5.3(QD)
N$101: IC15.18(ENCB_DCEN_CFG4) U5.2(QC)
N$102: IC15.19(ENCA_DCIN_CFG5) U5.1(QB)
N$103: IC17.1(OE) U5.7(QH)
N$104: IC17.2(I) U5.6(QG)
N$105: IC16.1(OE) U5.5(QF)
N$106: IC16.2(I) U5.4(QE)
N$107: C70.1 IC15.26(VCC) R52.2
N$108: C71.1 IC1.26(VCC) R53.2
N$109: C73.1 IC5.26(VCC) R70.2
N$110: C72.1 IC2.26(VCC) R59.2
N$111: C74.1 IC12.26(VCC) R71.2
N$112: IC12.32(OA2) X17.1
N$113: IC15.13(OB1) X18.3
N$114: LED7.C Q5.3(C) X6.2
N$115: LED6.C Q4.3(C) X5.2
N$116: LED5.C Q7.3(C) X4.2
N$117: LED6.A R20.1
N$118: LED7.A R21.1
N$119: IC15.32(OA2) X18.1
N$120: SV2.3 U11.8(LED2)
N$121: SV2.2 U11.7(LED1)
N$127: LED3.A R15.1
N$129: LED1.A R14.1
N$130: LED2.A R16.1
N$233: R42.2 R43.1 U10.7(FB)
N$234: C59.1 D1.A LED3.C Q3.5(D) Q3.6(D) Q3.7(D) Q3.8(D) Q3.TH(D) R55.1 X3.2
N$237: R13.1 R38.1 X8.2
N$238: C55.2 D4.C L2.P$2 U10.5(SW)
N$240: R18.1 R40.1 X11.2
N$241: R17.1 R39.1 X7.2
N$242: C58.1 D2.A LED2.C Q1.5(D) Q1.6(D) Q1.7(D) Q1.8(D) Q1.TH(D) R56.1 X20.3 X20.4
N$243: C54.1 U10.10(SS)
N$244: C56.1 U10.8(COMP)
N$245: C55.1 U10.2(BOOT)
N$246: C56.2 R44.1
SER_2: U1.9(QH_2) U2.14(SER)
SER_3: U2.9(QH_2) U3.14(SER)
SER_4: U3.9(QH_2) U4.14(SER)
SER_5: U4.9(QH_2) U5.14(SER)
SERVO_0: IC6.2(I) P9.14
SERVO_0_EN: IC6.1(OE) U2.15(QA)
SERVO_1: IC7.2(I) P9.16
SERVO_1_EN: IC7.1(OE) U3.15(QA)
SPI1_CS1: P9.42 U1.12(RCLK) U2.12(RCLK) U3.12(RCLK) U4.12(RCLK) U5.12(RCLK)
SPI1_MOSI: P9.30 U1.14(SER)
SPI1_SCLK: P9.31 U1.11(SRCLK) U2.11(SRCLK) U3.11(SRCLK) U4.11(SRCLK) U5.11(SRCLK)
STEP_E: IC12.6(REFL_STEP) P9.12
STEP_H: IC15.6(REFL_STEP) P8.11
STEP_X: IC1.6(REFL_STEP) P8.17
STEP_Y: IC2.6(REFL_STEP) P8.12
STEP_Z: IC5.6(REFL_STEP) P8.13
SYS_5V: C17.1 P9.7 P9.8 U11.1(A0) U11.2(A1) U11.3(A2) U11.4(A3) U11.5(A4) U11.24(A5) U11.28(VDD)
TERM_EXT1: C26.1 P9.33 R38.2
TERM_EXT2: C46.1 P9.36 R40.2
TERM_HBP: C45.1 P9.35 R39.2
TRISTATE_STEPPERS: IC18.1(OE) IC19.1(OE) IC20.1(OE) IC21.1(OE) IC22.1(OE) U5.15(QA)
VDD_5V: 5V.TP C48.1 C80.1 C82.1 C83.1 IC6.5(VCC) IC7.5(VCC) L1.P$1 P9.5 P9.6 R12.1 R61.2 R62.2 R63.2 R64.2 R65.2 R66.2 X1.3 X10.3 X12.3 X13.3 X19.3 X22.3 ; supply symbol labelled +5V
VDD_12V: 12V.TP C53.1 C81.1 L2.P$1 R11.2 R19.2 R20.2 R21.2 R25.2 R42.1 X4.1 X5.1 X6.1 X9.1 X12.4
VDD_ADC: P9.32 R13.2 R17.2 R18.2
VDD_IN: 12..24V.TP C4.1 C6.1 C8.1 C10.1 C19.1 C20.2 C22.2 C27.1 C28.2 C29.1 C31.1 C32.2 C35.2 C38.2 C40.1 C43.1 C47.1 C52.1 C64.2 C66.2 C67.2 C69.2 C89.1 C90.1 C91.1 C92.1 C93.1 C94.+ C95.+ C96.+ C97.+ C98.+ D1.C D2.C D3.C D5.C F1.P$3 F1.P$4 IC1.16(VS) IC1.30(VSA) IC1.31(VS) IC2.16(VS) IC2.30(VSA) IC2.31(VS) IC5.16(VS) IC5.30(VSA) IC5.31(VS) IC12.16(VS) IC12.30(VSA) IC12.31(VS) IC15.16(VS) IC15.30(VSA) IC15.31(VS) R14.2 R15.2 R16.2 R45.1 R55.2 R56.2 R57.2 U6.4(VIN) U10.4(VIN) X3.1 X20.1 X20.2 X21.1
VIN: F1.P$1 F1.P$2 LED8.A X2.3 X2.4
X_A1: IC1.34(OA1) X14.2
X_A2: IC1.32(OA2) X14.1
X_B1: IC1.13(OB1) X14.3
X_B2: IC1.15(OB2) X14.4
X_CFG1: IC1.4(SDI_NAI_CFG1) IC4.4(O)
X_CFG2: IC1.3(SCK_CFG2) IC3.4(O)
Unconnected: IC1.2(CSN_CFG3) IC1.9(SD_MODE) IC1.17(ENCN_DCO) IC1.21(SWP_DIAG1) IC2.2(CSN_CFG3) IC2.9(SD_MODE) IC2.17(ENCN_DCO) IC2.21(SWP_DIAG1) IC5.2(CSN_CFG3) IC5.9(SD_MODE) IC5.17(ENCN_DCO) IC5.21(SWP_DIAG1) IC12.2(CSN_CFG3) IC12.9(SD_MODE) IC12.17(ENCN_DCO) IC12.21(SWP_DIAG1) IC15.2(CSN_CFG3) IC15.9(SD_MODE) IC15.17(ENCN_DCO) IC15.21(SWP_DIAG1) P8.3 P8.4 P8.5 P8.6 P8.7 P8.20 P8.21 P8.22 P8.23 P8.24 P8.25 P8.27 P8.28 P8.29 P8.30 P8.31 P8.32 P8.33 P8.34 P8.35 P8.36 P8.37 P8.38 P8.39 P8.40 P8.41 P8.42 P8.43 P8.44 P8.45 P8.46 P9.9 P9.10 P9.15 P9.17 P9.21 P9.26 P9.27 P9.29 P9.34 P9.37 P9.38 P9.39 P9.40 U5.9(QH_2) U6.9(EN) U10.9(EN) U11.12(LED6) U11.25(EXTCLK) U18.7(~WC) U19.13(NC_2) U19.16(NC)

## Notes on the sheet
- End stops 1
- End stops 2
- Thermistors
- PWM extension
- MOSFET E
- Power in
- Fan drivers
- Dallas 1W
- EEPROM
- 12V step down converter
- MOSFET HBP
- MOSFET H
- 5V step down converter

## Library data of the parts
3.3V 5V 12..24V 12V = testpad:TP: Test pad
C1 C3 C7 C9 C39 = rcl:C-EU: CAPACITOR, European symbol; MPN: C1005X7R1E223K050BB
C2 C4-C6 C8 C10 C13-C15 C17 C19 C20 C22 C23 C27-C32 C35 C38 C40-C44 C61 C63 C64 C66 C67 C69-C74 C82-C88 = rcl:C-EU: CAPACITOR, European symbol; MPN: CL10B104KB8NNND
C12 C18 C21 C25 C26 C33 C36 C37 C45 C46 C62 C65 C68 C75-C79 = rcl:C-EU: CAPACITOR, European symbol; MPN: GRM155R60J475ME47D
C47 C48 C52 C53 C80 C81 = rcl:C-EU: CAPACITOR, European symbol; MPN: CL31B106KAHNNNE
C49 C50 C54 C55 = rcl:C-EU: CAPACITOR, European symbol; MPN: CL05B103KB5NNNC
C51 C56 = rcl:C-EU: CAPACITOR, European symbol; MPN: C1005X7R1H102K050BA
C57-C59 = rcl:C-EU: CAPACITOR, European symbol; MPN: CL05B472KA5NNNC
C89-C93 = rcl:C-EU: CAPACITOR, European symbol; MPN: C2012X5R1V106M085AC
C94-C98 = Panasonic-EEEFK_EEEFP:C; MPN: RHS1V101MCN1GS
D1-D6 = diode:MBRA340T3: Surface Mount Schottky Power Rectifier Source: http://www.onsemi.com/pub_link/Collateral/MBRA340T3-D.PDF; MPN: MBRA340T3G
F1 = fuse:FUSE: Fuse; MPN: 0891020.NXS
FH1 FH2 = Replicape_Rev_B0:FUSE-HOLDER; MPN: 3557
IC1 IC2 IC5 IC12 IC15 = we-chip:TMC2100: Trinamic TMC2100 Stepper Motor Driver (5V...46V, 1.2A, peak 1.7A, 256 microsteps); MPN: TMC2100-LA-T
IC3 IC4 IC6-IC11 IC13 IC14 IC16-IC22 = 74xx-little-de:74*1G126: Single Bus Buffer Gate With 3-State Outputs; MPN: M74VHC1GT126DF1G
JP1 JP2 = SparkFun:FIDUCIAL: Fiducial Alignment Points Various fiducial points for machine vision alignment.
L1 L2 = SparkFun:RT8040T330; MPN: NR8040T330M
LED0 LED1-LED8 = led:LED: LED OSRAM: - CHIPLED LG R971, LG N971, LY N971, LG Q971, LY Q971, LO R971, LY R971 LH N974, LH R974 LS Q976, LO Q976, LY Q976 LO Q996 - Hyper CHIPLED LW Q18S LB Q993, LB Q99A, LB R99A - SideLED LS A670, LO A670, LY A670, LG A670, LP A670 LB A673, LV A673, LT A673, LW A673 LH A674 LY A675 LS A676, LA A676, LO A676, LY A676, LW A676 LS A679, LY A679, LG A679 - Hyper Micro SIDELED® LS Y876, LA Y876, LO Y876, LY Y876 LT Y87S - SmartLED LW L88C, LW L88S LB L89C, LB L89S, LG L890 LS L89K, LO L89K, LY L89K LS L896, LA L896, LO L896, LY L896 - TOPLED LS T670, LO T670, LY T670, LG T670, LP T670 LSG T670, LSP T670, LSY T670, LOP T670, LYG T670 LG T671, LOG T671, LSG T671 LB T673, LV T673, LT T673, LW T673 LH T674 LS T676, LA T676, LO T676, LY T676, LB T676, LH T676, LSB T676, LW T676 LB T67C, LV T67C, LT T67C, LS T67K, LO T67K, LY T67K, LW E67C LS E67B, LA E67B, LO E67B, LY E67B, LB E67C, LV E67C, LT E67C LW T67C LS T679, LY T679, LG T679 LS T770, LO T770, LY T770, LG T770, LP T770 LB T773, LV T773, LT T773, LW T773 LH T774 LS E675, LA E675, LY E675, LS T675 LS T776, LA T776, LO T776, LY T776, LB T776 LHGB T686 LT T68C, LB T68C - Hyper Mini TOPLED® LB M676 - Mini TOPLED Santana® LG M470 LS M47K, LO M47K, LY M47K Source: http://www.osram.convergy.de LUXEON: - LUMILED® LXK2-PW12-R00, LXK2-PW12-S00, LXK2-PW14-U00, LXK2-PW14-V00 LXK2-PM12-R00, LXK2-PM12-S00, LXK2-PM14-U00 LXK2-PE12-Q00, LXK2-PE12-R00, LXK2-PE12-S00, LXK2-PE14-T00, LXK2-PE14-U00 LXK2-PB12-K00, LXK2-PB12-L00, LXK2-PB12-M00, LXK2-PB14-N00, LXK2-PB14-P00, LXK2-PB14-Q00 LXK2-PR12-L00, LXK2-PR12-M00, LXK2-PR14-Q00, LXK2-PR14-R00 LXK2-PD12-Q00, LXK2-PD12-R00, LXK2-PD12-S00 LXK2-PH12-R00, LXK2-PH12-S00 LXK2-PL12-P00, LXK2-PL12-Q00, LXK2-PL12-R00 Source: www.luxeon.com KINGBRIGHT: KA-3528ASYC Source: www.kingbright.com; MPN: Q65110A7211
LOGO1 = ohw-logo:OSHW_LOGO_FILL
P8 P9 = con-headers-jp:F-2X23-; MPN: SSHQ-123-D-08-F-LF
Q1-Q3 = transistor-power:AON6758; MPN: SIRA34DP-T1-GE3
Q4-Q7 = semicon-smd-ipc:NPN-TRANSISTOR_: NPN TRANSISTOR; MPN: AO7400
R1-R4 R7-R10 R29 R30 = rcl:R-EU_: RESISTOR, European symbol; MPN: RL1220S-R10-F
R5 R11 R14-R16 R19-R21 R23-R25 R28 R32-R34 R36 R45-R48 R51 R54-R57 R61-R66 = rcl:R-EU_: RESISTOR, European symbol; MPN: RC0402JR-074K7L
R6 R22 R27 R31 R35 R37-R41 R43 R49 R50 R58 R60 = rcl:R-EU_: RESISTOR, European symbol; MPN: RC0402FR-0710KL
R12 = rcl:R-EU_: RESISTOR, European symbol; MPN: RC1005F4422CS
R13 R17 R18 = rcl:R-EU_: RESISTOR, European symbol; MPN: RC0402FR-074K7L
R26 R44 = rcl:R-EU_: RESISTOR, European symbol; MPN: RC1005J393CS
R42 = rcl:R-EU_: RESISTOR, European symbol; MPN: RMCF0402FT120K
R52 R53 R59 R70 R71 = rcl:R-EU_: RESISTOR, European symbol; MPN: RC1005J2R2CS
SV2 = con-lstb:MA03-1: PIN HEADER; OC_FARNELL: unknown; OC_NEWARK: unknown
U1-U5 = sn74hc595:SN74AHC595PW: 8 bit shift registers with 3-state output registers; MPN: MC74HC595ADTR2G; OC_FARNELL: 1741463; OC_NEWARK: 50R5930; PACKAGE: TSSOP-16; SUPPLIER: Texas Instruments
U6 U10 = SparkFun:RT8268; MPN: RT8268GFP
U11 = custom:PCA9685PW: 16-channel, 12-bit PWM Fm+ I2C-bus LED controller; MPN: PCA9685PW,112; OC_FARNELL: 1854074; OC_NEWARK: 19T6398; PACKAGE: TSSOP-28; SUPPLIER: NXP
U18 = custom:CAT24C256; MPN: CAT24C256WI-GT3
U19 = TI-CD4050BD:CD4050BD: CMOS Hex Buffer/Converters; MPN: CD4050BDR; OC_FARNELL: 1740857; OC_NEWARK: 50R5062; PACKAGE: 16-SOIC; SUPPLIER: Texas Instruments
U$4 = Replicape_B3:CC-BY-SA
X1 X10 X13 X19 X22 X23 = con-molex:22-?-03: CONNECTOR wire to board 2.54 mm (.1 inch) pitch header; MPN: 640455-3; OC_FARNELL: unknown; OC_NEWARK: unknown
X2 X20 = con-phoenix-508:MSTBA4: PHOENIX; MF: FARNELL; MPN: 39532-1004; OC_FARNELL: 3705195; OC_NEWARK: 71C4163
X3 X21 = con-phoenix-508:MSTBA2: PHOENIX; MF: FARNELL; MPN: 39532-1002; OC_FARNELL: 3705171; OC_NEWARK: 71C4161
X4-X9 X11 = con-molex:22-?-02: CONNECTOR wire to board 2.54 mm (.1 inch) pitch header; MPN: 640455-2; OC_FARNELL: 9731601; OC_NEWARK: unknown
X12 X14-X18 = con-molex:22-?-04: CONNECTOR wire to board 2.54 mm (.1 inch) pitch header; MPN: 640455-4; OC_FARNELL: unknown; OC_NEWARK: unknown
XC1 XC2 = con-phoenix-508:MSTBA4-CONNECTOR; MPN: 39530-0004
XC3 XC4 = con-phoenix-508:MSTBV2-CONNECTOR; MPN: 39530-0002

## Net classes
1 power: width 1.27 mm